# EAGLE design TinyUART (EAGLE 6.5.0)
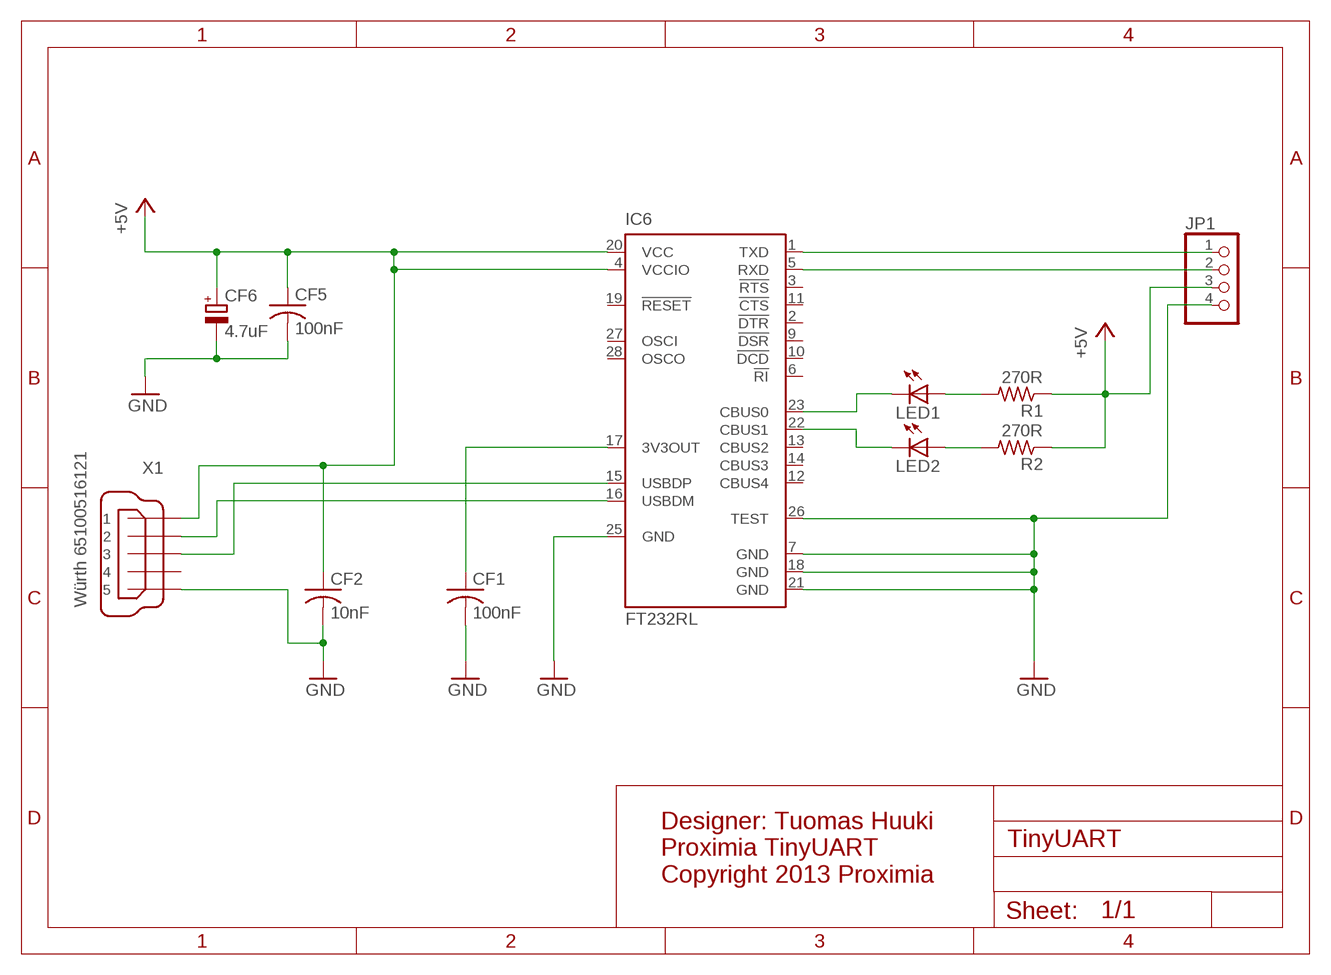
[diagram p0: schematic, sheet 1]

## Parts
CF1  100nF  C-USC0603  [C0603]
CF2  10nF  C-USC0603  [C0603]
CF5  100nF  C-USC0603  [C0603]
CF6  4.7uF  CPOL-EUB  [PANASONIC_B]
IC6  FT232RL  [SSOP28]
JP1  PINHD-1X4  [1X04]
LED1  LEDSML1206  [SML1206]
LED2  LEDSML1206  [SML1206]
R1  270R  R-US_R0603  [R0603]
R2  270R  R-US_R0603  [R0603]
X1  Würth 65100516121  MINI-USB-32005-301  [32005-301]

## Nets
+5V: CF2.1 CF5.1 CF6.+ IC6.4(VCCIO) IC6.20(VCC) JP1.3 R1.1 R2.1 X1.1
GND: CF1.2 CF2.2 CF5.2 CF6.- IC6.7(GND) IC6.18(GND) IC6.21(GND) IC6.25(GND) IC6.26(TEST) JP1.4 X1.5
N$1: IC6.1(TXD) JP1.1
N$2: IC6.5(RXD) JP1.2
N$83: IC6.15(USBDP) X1.3
N$84: IC6.16(USBDM) X1.2
N$87: LED1.A R1.2
N$88: LED2.A R2.2
N$89: IC6.23(CBUS0) LED1.C
N$90: IC6.22(CBUS1) LED2.C
N$91: CF1.1 IC6.17(3V3OUT)
Unconnected: IC6.2(!DTR) IC6.3(!RTS) IC6.6(!RI) IC6.9(!DSR) IC6.10(!DCD) IC6.11(!CTS) IC6.12(CBUS4) IC6.13(CBUS2) IC6.14(CBUS3) IC6.19(!RESET) IC6.27(OSCI) IC6.28(OSCO) X1.4

## Notes on the sheet
- Designer: Tuomas Huuki
  Proximia TinyUART
  Copyright 2013 Proximia

## Library data of the parts
CF1 CF2 CF5 = rcl:C-US: CAPACITOR, American symbol
CF6 = resistor:CPOL-EU: POLARIZED CAPACITOR, European symbol
IC6 = ftdichip:FT232R: Source: http://www.ftdichip.com/Documents/DataSheets/DS_FT232R_v104.pdf; MPN: FT232RL; OC_FARNELL: 1146032; OC_NEWARK: 91K9918
JP1 = pinhead:PINHD-1X4: PIN HEADER
LED1 LED2 = led:LED: LED OSRAM: - CHIPLED LG R971, LG N971, LY N971, LG Q971, LY Q971, LO R971, LY R971 LH N974, LH R974 LS Q976, LO Q976, LY Q976 LO Q996 - Hyper CHIPLED LW Q18S LB Q993, LB Q99A, LB R99A - SideLED LS A670, LO A670, LY A670, LG A670, LP A670 LB A673, LV A673, LT A673, LW A673 LH A674 LY A675 LS A676, LA A676, LO A676, LY A676, LW A676 LS A679, LY A679, LG A679 - Hyper Micro SIDELED® LS Y876, LA Y876, LO Y876, LY Y876 LT Y87S - SmartLED LW L88C, LW L88S LB L89C, LB L89S, LG L890 LS L89K, LO L89K, LY L89K LS L896, LA L896, LO L896, LY L896 - TOPLED LS T670, LO T670, LY T670, LG T670, LP T670 LSG T670, LSP T670, LSY T670, LOP T670, LYG T670 LG T671, LOG T671, LSG T671 LB T673, LV T673, LT T673, LW T673 LH T674 LS T676, LA T676, LO T676, LY T676, LB T676, LH T676, LSB T676, LW T676 LB T67C, LV T67C, LT T67C, LS T67K, LO T67K, LY T67K, LW E67C LS E67B, LA E67B, LO E67B, LY E67B, LB E67C, LV E67C, LT E67C LW T67C LS T679, LY T679, LG T679 LS T770, LO T770, LY T770, LG T770, LP T770 LB T773, LV T773, LT T773, LW T773 LH T774 LS E675, LA E675, LY E675, LS T675 LS T776, LA T776, LO T776, LY T776, LB T776 LHGB T686 LT T68C, LB T68C - Hyper Mini TOPLED® LB M676 - Mini TOPLED Santana® LG M470 LS M47K, LO M47K, LY M47K Source: http://www.osram.convergy.de LUXEON: - LUMILED® LXK2-PW12-R00, LXK2-PW12-S00, LXK2-PW14-U00, LXK2-PW14-V00 LXK2-PM12-R00, LXK2-PM12-S00, LXK2-PM14-U00 LXK2-PE12-Q00, LXK2-PE12-R00, LXK2-PE12-S00, LXK2-PE14-T00, LXK2-PE14-U00 LXK2-PB12-K00, LXK2-PB12-L00, LXK2-PB12-M00, LXK2-PB14-N00, LXK2-PB14-P00, LXK2-PB14-Q00 LXK2-PR12-L00, LXK2-PR12-M00, LXK2-PR14-Q00, LXK2-PR14-R00 LXK2-PD12-Q00, LXK2-PD12-R00, LXK2-PD12-S00 LXK2-PH12-R00, LXK2-PH12-S00 LXK2-PL12-P00, LXK2-PL12-Q00, LXK2-PL12-R00 Source: www.luxeon.com KINGBRIGHT: KA-3528ASYC Source: www.kingbright.com
R1 R2 = rcl:R-US_: RESISTOR, American symbol
X1 = con-cypressindustries:MINI-USB-: MINI USB-B Conector Source: www.cypressindustries.com; OC_FARNELL: unknown; OC_NEWARK: unknown

## Board
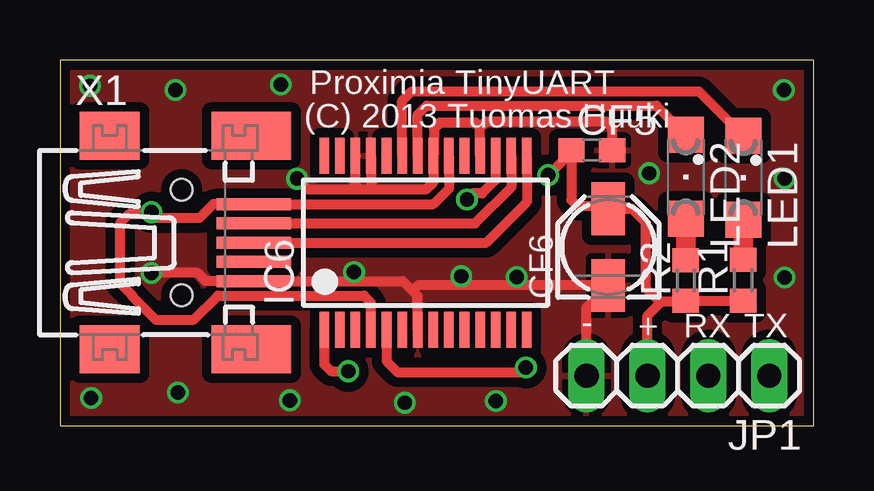
[diagram p1: board, top side]
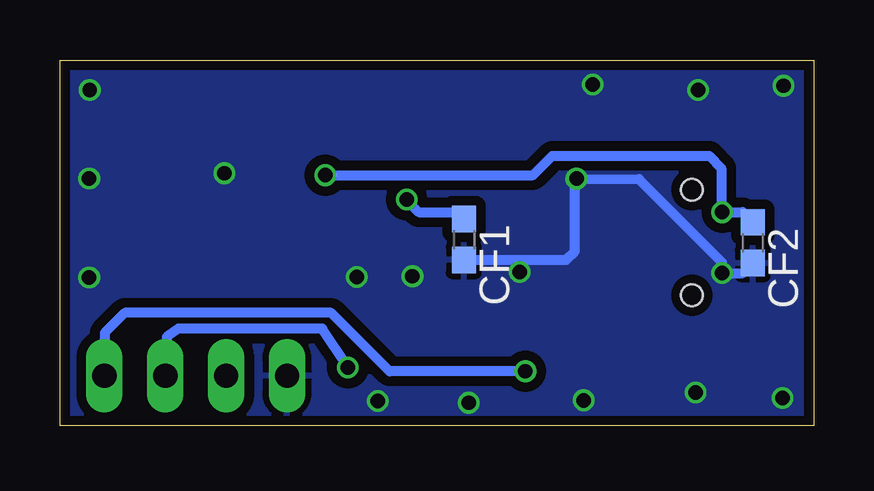
[diagram p2: board, bottom side, seen from below]

Size 31.42 x 15.23 mm. Coordinates in mm from the lower left corner, seen from the top.
Outline: 0,0 31.42,0 31.42,15.23 0,15.23 0,0
Copper layers (1*16): Top 0.035mm / dielectric 1.5mm / Bottom 0.035mm
Design rules "ITEADstudio_DRC": minimum track width 6mil, minimum drill 12mil, track to track 6mil, track to pad 6mil, pad to pad 6mil, via to via 6mil, smd to smd 0mil, copper to edge 10mil, drill to drill 10mil, minimum pad ring 10mil, minimum via ring 6mil, stop-mask expansion 2mil, vias tented up to drill 100mil, thermal gap 10mil

### Footprints (pad centres in the part's own frame; a part is rotated, then mirrored left to right if it is on the bottom)
C0603 = smd 1.1 x 1: 1 -0.85,0; 2 0.85,0
PANASONIC_B = smd 2.2 x 1.4: + 1.6,0; - -1.6,0
SSOP28 = smd 0.4 x 1.5: 1 -4.225,-3.625; 2 -3.575,-3.625; 3 -2.925,-3.625; 4 -2.275,-3.625; 5 -1.625,-3.625; 6 -0.975,-3.625; 7 -0.325,-3.625; 8 0.325,-3.625; 9 0.975,-3.625; 10 1.625,-3.625; 11 2.275,-3.625; 12 2.925,-3.625; 13 3.575,-3.625; 14 4.225,-3.625; 15 4.225,3.625; 16 3.575,3.625; 17 2.925,3.625; 18 2.275,3.625; 19 1.625,3.625; 20 0.975,3.625; 21 0.325,3.625; 22 -0.325,3.625; 23 -0.975,3.625; 24 -1.625,3.625; 25 -2.275,3.625; 26 -2.925,3.625; 27 -3.575,3.625; 28 -4.225,3.625
1X04 = drill 1.016 long: 1 -3.81,0; 2 -1.27,0; 3 1.27,0; 4 3.81,0
SML1206 = smd 1.5 x 1.5: A 1.75,0; C -1.75,0
R0603 = smd 1 x 1.1: 1 -0.85,0; 2 0.85,0
32005-301 = smd 3.1 x 0.5: 1 3,1.6; 2 3,0.8; 3 3,0; 4 3,-0.8; 5 3,-1.6 | smd 2.5 x 2: M1 -3,-4.45; M2 -3,4.45 | smd 3.3 x 2: M3 2.9,4.45; M4 2.9,-4.45 | hole 0.9: 0,2.2; 0,-2.2

### Placement (x,y rotation side)
CF1  14.58,7.75 270 bottom
CF2  2.54,7.62 270 bottom
CF5  22.17,11.47 0 top
CF6  22.86,7.44 90 top
IC6  15.24,7.62 0 top
JP1  25.76,2.08 180 top
LED1  28.48,10.33 270 top
LED2  26.09,10.36 270 top
R1  28.48,6.05 90 top
R2  26.09,6.04 90 top
X1  5.08,7.62 0 top

### Tracks (layer width: path | path; a pad name or v marks a point on that pad's centre or on a via)
+5V  (via drill 0.6)
  Top 0.406: IC6.20 16.21,9.87 15.57,9.22 X1.1 6.39,9.22 5.81,8.64 4.06,8.64 v3.81,8.89 3.74,8.82 2.89,8.82 2.51,8.44 2.51,5.92 3.02,5.41 3.02,5.37 3.98,4.41 5.58,4.41 6.59,5.41 12.68,5.41 12.96,5.12 IC6.4 | 25.1,5.17 24.98,5.17 24.41,5.74 24.41,8.46 23.84,9.04 CF6.+ 22.74,9.15 21.56,9.15 21.32,9.39 CF5.1 21.32,11.4 v20.36,10.43 | 25.1,5.17 26.07,5.17 R2.1 R1.1 | JP1.3 24.49,4.56 25.1,5.17
  Bottom 0.406: CF2.1 2.96,8.89 v3.81,8.89 3.85,8.93 3.85,10.73 4.35,11.23 10.89,11.23 11.69,10.43 v20.36,10.43
GND  (via drill 0.6)
  Top 0.406: IC6.7 14.91,5.41 14.7,5.62 | 14.7,5.62 14.3,6.02 X1.5 6.07,6.02 5.73,6.36 v3.82,6.36 v3.81,6.35 | 13,9.83 15.25,9.83 15.56,10.14 IC6.21 15.59,11.27 15.59,12.38 15.83,12.62 17.33,12.62 17.52,12.44 | 13,9.83 12.5,9.83 | 12.5,9.83 12.33,10 12.33,11.23 IC6.26 | IC6.25 12.96,9.86 13,9.83 | 12.5,9.83 10.34,9.83 v9.89,10.28 | 14.7,5.62 14.93,5.84 CF6.- 21.95,4.93 JP1.4 | IC6.18 17.52,12.44 | CF5.2 23.02,12.39 22.75,12.66 17.73,12.66 17.52,12.44
  Bottom 0.406: CF2.2 2.96,6.35 v3.81,6.35 3.81,6.79 7.28,10.27 v9.89,10.28 9.96,10.21 9.96,7.25 10.31,6.9 CF1.2
  other vias: 4.92,1.37 1.3,1.15 9.59,1.05 9.21,14.21 1.25,14.16 4.82,13.98 19.05,6.19 16.73,6.22 24.56,10.51 30.2,10.29 30.18,13.98 30.2,6.17 18.17,1.02 14.38,0.95 12.26,6.39
  pour Top (isolate 0.406): 0.02,15.21 31.38,15.21 31.38,-0.02 0.07,-0.02 0.07,0.02
  pour Bottom (isolate 0.406): 0.07,15.16 31.4,15.16 31.4,0.05 0.05,0.05
N$1  (via drill 0.6)
  Top 0.406: IC6.1 11.02,2.55 11.3,2.27 12.01,2.27 v12.02,2.26
  Bottom 0.406: v12.02,2.26 17.67,2.26 20.11,4.7 28.72,4.7 29.55,3.86 29.55,2.09 JP1.1
N$2  (via drill 0.6)
  Top 0.406: IC6.5 13.62,2.68 14.07,2.22 19.23,2.22 v19.42,2.41
  Bottom 0.406: v19.42,2.41 19.42,2.45 20.49,4.04 26.49,4.04 26.96,3.69 26.96,2.14 JP1.2
N$83
  Top 0.406: X1.3 17.78,7.62 19.46,9.3 IC6.15
N$84
  Top 0.406: IC6.16 18.82,9.93 17.31,8.42 X1.2
N$87
  Top 0.813: R1.2 LED1.A
N$88
  Top 0.813: R2.2 LED2.A
N$89
  Top 0.406: IC6.23 14.27,13.53 14.66,13.93 26.64,13.93 LED1.C
N$90
  Top 0.406: IC6.22 14.91,12.96 15.29,13.33 24.87,13.33 LED2.C
N$91  (via drill 0.6)
  Top 0.406: IC6.17 18.16,10.24 17.59,9.67 17.21,9.67 v16.97,9.42
  Bottom 0.406: v16.97,9.42 16.97,9.38 16.47,8.89 14.87,8.89 CF1.1

### Text on the board
_tsilk: Proximia TinyUART | (C) 2013 Tuomas Huuki | - | + | RX | TX